# Altium schematic sheet A3_SH1(No_Logo).SchDoc
size A3; SheetNumber: 4; SheetTotal: 6
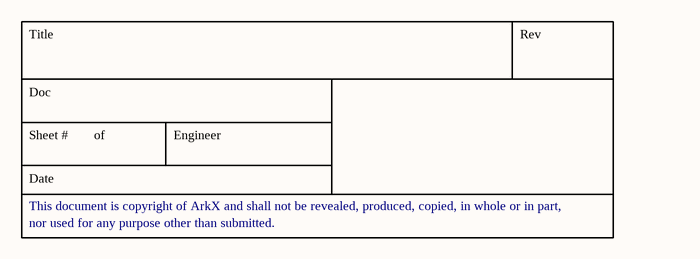
[diagram p0: A3_SH1(No_Logo).SchDoc]

## Notes on the sheet
- Title
- Rev
- Doc
- Sheet #
- of
- Engineer
- This document is copyright of ArkX and shall not be revealed, produced, copied, in whole or in part,
- Date
- nor used for any purpose other than submitted.